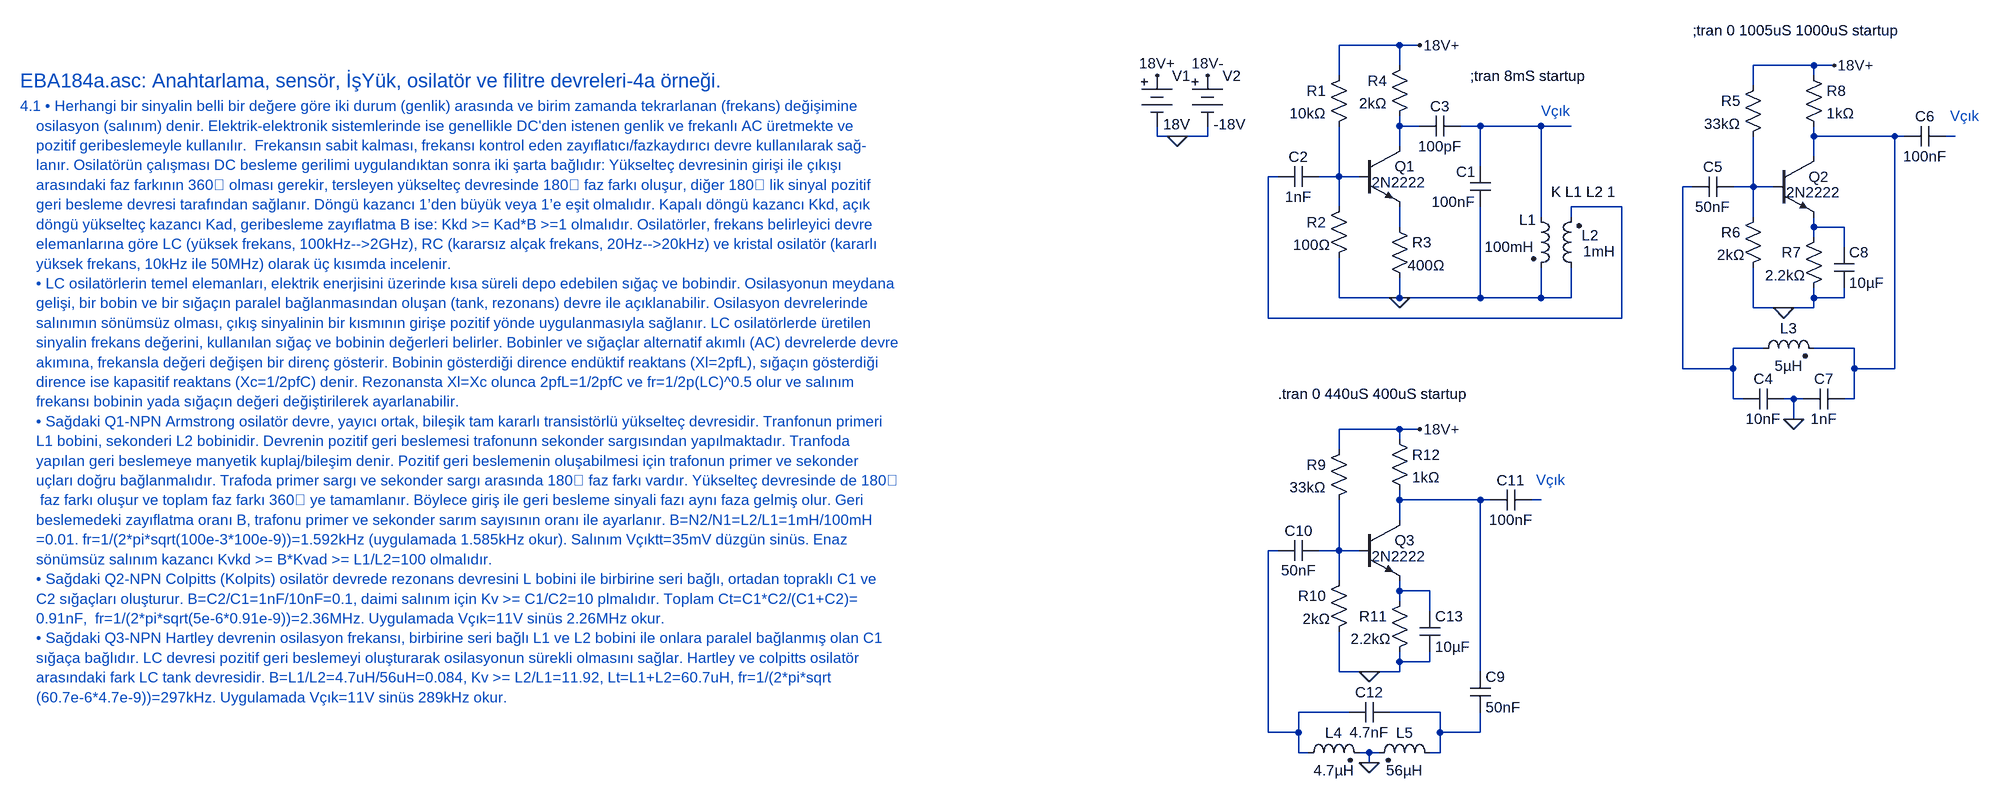
[diagram p0: schematic EBA184a.asc]
EBA184a.asc, the LTspice schematic file:
Version 4
SHEET 1 7064 4332
WIRE 1952 0 1856 0
WIRE 1984 0 1952 0
WIRE 1952 32 1952 0
WIRE 2608 32 2512 32
WIRE 2640 32 2608 32
WIRE 1856 48 1856 0
WIRE 2608 48 2608 32
WIRE 2512 64 2512 32
WIRE 1952 128 1952 112
WIRE 1984 128 1952 128
WIRE 2080 128 2048 128
WIRE 2176 128 2080 128
WIRE 2224 128 2176 128
WIRE 1568 144 1568 128
WIRE 1600 144 1568 144
WIRE 1648 144 1648 128
WIRE 1648 144 1600 144
WIRE 2608 144 2608 128
WIRE 2736 144 2608 144
WIRE 2752 144 2736 144
WIRE 2832 144 2816 144
WIRE 1952 160 1952 128
WIRE 2608 176 2608 144
WIRE 2080 192 2080 128
WIRE 1760 208 1744 208
WIRE 1856 208 1856 128
WIRE 1856 208 1824 208
WIRE 1888 208 1856 208
WIRE 2416 224 2400 224
WIRE 2512 224 2512 144
WIRE 2512 224 2480 224
WIRE 2544 224 2512 224
WIRE 1856 256 1856 208
WIRE 2304 256 2224 256
WIRE 2176 272 2176 128
WIRE 2224 272 2224 256
WIRE 2512 272 2512 224
WIRE 1952 288 1952 256
WIRE 2608 288 2608 272
WIRE 2656 288 2608 288
WIRE 2608 304 2608 288
WIRE 2656 320 2656 288
WIRE 1856 400 1856 336
WIRE 1952 400 1952 368
WIRE 1952 400 1856 400
WIRE 2080 400 2080 256
WIRE 2080 400 1952 400
WIRE 2176 400 2176 352
WIRE 2176 400 2080 400
WIRE 2224 400 2224 352
WIRE 2224 400 2176 400
WIRE 2608 400 2608 384
WIRE 2656 400 2656 384
WIRE 2656 400 2608 400
WIRE 2512 416 2512 352
WIRE 2560 416 2512 416
WIRE 2608 416 2608 400
WIRE 2608 416 2560 416
WIRE 1744 432 1744 208
WIRE 2304 432 2304 256
WIRE 2304 432 1744 432
WIRE 2528 480 2480 480
WIRE 2672 480 2608 480
WIRE 2400 512 2400 224
WIRE 2480 512 2480 480
WIRE 2480 512 2400 512
WIRE 2672 512 2672 480
WIRE 2736 512 2736 144
WIRE 2736 512 2672 512
WIRE 2480 560 2480 512
WIRE 2496 560 2480 560
WIRE 2576 560 2560 560
WIRE 2592 560 2576 560
WIRE 2672 560 2672 512
WIRE 2672 560 2656 560
WIRE 2576 592 2576 560
WIRE 1952 608 1856 608
WIRE 1984 608 1952 608
WIRE 1952 624 1952 608
WIRE 1856 640 1856 608
WIRE 1952 720 1952 704
WIRE 2080 720 1952 720
WIRE 2096 720 2080 720
WIRE 2176 720 2160 720
WIRE 1952 752 1952 720
WIRE 1760 800 1744 800
WIRE 1856 800 1856 720
WIRE 1856 800 1824 800
WIRE 1888 800 1856 800
WIRE 1856 848 1856 800
WIRE 1952 864 1952 848
WIRE 2000 864 1952 864
WIRE 1952 880 1952 864
WIRE 2000 896 2000 864
WIRE 1952 976 1952 960
WIRE 2000 976 2000 960
WIRE 2000 976 1952 976
WIRE 1856 992 1856 928
WIRE 1904 992 1856 992
WIRE 1952 992 1952 976
WIRE 1952 992 1904 992
WIRE 2080 992 2080 720
WIRE 1872 1056 1792 1056
WIRE 2016 1056 1936 1056
WIRE 1744 1088 1744 800
WIRE 1792 1088 1792 1056
WIRE 1792 1088 1744 1088
WIRE 2016 1088 2016 1056
WIRE 2080 1088 2080 1056
WIRE 2080 1088 2016 1088
WIRE 1792 1120 1792 1088
WIRE 1808 1120 1792 1120
WIRE 1904 1120 1888 1120
WIRE 1920 1120 1904 1120
WIRE 2016 1120 2016 1088
WIRE 2016 1120 2000 1120
WIRE 1904 1136 1904 1120
FLAG 1568 48 18V+
FLAG 1600 144 0
FLAG 1648 48 18V-
FLAG 1952 400 0
FLAG 1984 0 18V+
FLAG 2560 416 0
FLAG 2640 32 18V+
FLAG 2576 592 0
FLAG 1904 992 0
FLAG 1984 608 18V+
FLAG 1904 1136 0
SYMBOL Misc\\battery 1568 32 R0
WINDOW 3 10 93 Left 2
SYMATTR Value 18V
SYMATTR InstName V1
SYMBOL Misc\\battery 1648 32 R0
WINDOW 3 10 93 Left 2
SYMATTR Value -18V
SYMATTR InstName V2
SYMBOL npn 1888 160 R0
WINDOW 3 20 57 Left 2
SYMATTR Value 2N2222
SYMATTR InstName Q1
SYMBOL res 1872 32 M0
SYMATTR InstName R1
SYMATTR Value 10kΩ
SYMBOL res 1872 240 M0
WINDOW 3 29 76 Left 2
SYMATTR Value 100Ω
SYMATTR InstName R2
SYMBOL res 1936 272 R0
WINDOW 3 29 76 Left 2
SYMATTR Value 400Ω
SYMATTR InstName R3
SYMBOL cap 2096 192 M0
SYMATTR InstName C1
SYMATTR Value 100nF
SYMBOL ind2 2160 256 R0
WINDOW 0 -19 20 Left 2
WINDOW 3 -73 63 Left 2
SYMATTR InstName L1
SYMATTR Value 100mH
SYMATTR Type ind
SYMBOL ind2 2240 368 R180
WINDOW 0 -27 67 Left 2
WINDOW 3 -54 42 Left 2
SYMATTR InstName L2
SYMATTR Value 1mH
SYMATTR Type ind
SYMBOL cap 1824 224 M270
WINDOW 0 32 32 VTop 2
WINDOW 3 0 32 VBottom 2
SYMATTR InstName C2
SYMATTR Value 1nF
SYMBOL res 1968 16 M0
SYMATTR InstName R4
SYMATTR Value 2kΩ
SYMBOL cap 2048 144 M270
WINDOW 0 32 32 VTop 2
WINDOW 3 0 32 VBottom 2
SYMATTR InstName C3
SYMATTR Value 100pF
SYMBOL npn 2544 176 R0
WINDOW 3 20 57 Left 2
SYMATTR Value 2N2222
SYMATTR InstName Q2
SYMBOL res 2528 48 M0
SYMATTR InstName R5
SYMATTR Value 33kΩ
SYMBOL res 2528 256 M0
WINDOW 3 29 76 Left 2
SYMATTR Value 2kΩ
SYMATTR InstName R6
SYMBOL res 2624 288 M0
WINDOW 3 29 76 Left 2
SYMATTR Value 2.2kΩ
SYMATTR InstName R7
SYMBOL cap 2560 576 M270
WINDOW 0 32 32 VTop 2
WINDOW 3 0 32 VBottom 2
SYMATTR InstName C4
SYMATTR Value 10nF
SYMBOL ind2 2512 496 R270
WINDOW 0 32 56 VTop 2
WINDOW 3 4 56 VBottom 2
SYMATTR InstName L3
SYMATTR Value 5µH
SYMATTR Type ind
SYMBOL cap 2480 240 M270
WINDOW 0 32 32 VTop 2
WINDOW 3 0 32 VBottom 2
SYMATTR InstName C5
SYMATTR Value 50nF
SYMBOL res 2592 32 R0
SYMATTR InstName R8
SYMATTR Value 1kΩ
SYMBOL cap 2816 160 M270
WINDOW 0 32 32 VTop 2
WINDOW 3 0 32 VBottom 2
SYMATTR InstName C6
SYMATTR Value 100nF
SYMBOL cap 2656 576 M270
WINDOW 0 32 32 VTop 2
WINDOW 3 0 32 VBottom 2
SYMATTR InstName C7
SYMATTR Value 1nF
SYMBOL cap 2640 320 R0
SYMATTR InstName C8
SYMATTR Value 10µF
SYMBOL npn 1888 752 R0
WINDOW 3 20 57 Left 2
SYMATTR Value 2N2222
SYMATTR InstName Q3
SYMBOL res 1872 624 M0
SYMATTR InstName R9
SYMATTR Value 33kΩ
SYMBOL res 1872 832 M0
WINDOW 3 29 76 Left 2
SYMATTR Value 2kΩ
SYMATTR InstName R10
SYMBOL res 1968 864 M0
WINDOW 3 29 76 Left 2
SYMATTR Value 2.2kΩ
SYMATTR InstName R11
SYMBOL ind2 1792 1136 R270
WINDOW 0 32 56 VTop 2
WINDOW 3 4 56 VBottom 2
SYMATTR InstName L4
SYMATTR Value 4.7µH
SYMATTR Type ind
SYMBOL cap 1824 816 M270
WINDOW 0 32 32 VTop 2
WINDOW 3 0 32 VBottom 2
SYMATTR InstName C10
SYMATTR Value 50nF
SYMBOL res 1936 608 R0
SYMATTR InstName R12
SYMATTR Value 1kΩ
SYMBOL cap 2160 736 M270
WINDOW 0 32 32 VTop 2
WINDOW 3 0 32 VBottom 2
SYMATTR InstName C11
SYMATTR Value 100nF
SYMBOL cap 1936 1072 M270
WINDOW 0 32 32 VTop 2
WINDOW 3 0 32 VBottom 2
SYMATTR InstName C12
SYMATTR Value 4.7nF
SYMBOL cap 1984 896 R0
SYMATTR InstName C13
SYMATTR Value 10µF
SYMBOL ind2 2016 1136 M270
WINDOW 0 32 56 VTop 2
WINDOW 3 4 56 VBottom 2
SYMATTR InstName L5
SYMATTR Value 56µH
SYMATTR Type ind
SYMBOL cap 2064 992 R0
SYMATTR InstName C9
SYMATTR Value 50nF
TEXT -232 56 Left 3 ;EBA184a.asc: Anahtarlama, sensör, İşYük, osilatör ve filitre devreleri-4a örneği.
TEXT -232 96 Left 2 ;4.1 • Herhangi bir sinyalin belli bir değere göre iki durum (genlik) arasında ve birim zamanda tekrarlanan (frekans) değişimine \n    osilasyon (salınım) denir. Elektrik-elektronik sistemlerinde ise genellikle DC'den istenen genlik ve frekanlı AC üretmekte ve\n    pozitif geribeslemeyle kullanılır.  Frekansın sabit kalması, frekansı kontrol eden zayıflatıcı/fazkaydırıcı devre kullanılarak sağ-\n    lanır. Osilatörün çalışması DC besleme gerilimi uygulandıktan sonra iki şarta bağlıdır: Yükselteç devresinin girişi ile çıkışı \n    arasındaki faz farkının 360⁰ olması gerekir, tersleyen yükselteç devresinde 180⁰ faz farkı oluşur, diğer 180⁰ lik sinyal pozitif\n    geri besleme devresi tarafından sağlanır. Döngü kazancı 1’den büyük veya 1’e eşit olmalıdır. Kapalı döngü kazancı Kkd, açık\n    döngü yükselteç kazancı Kad, geribesleme zayıflatma B ise: Kkd >= Kad*B >=1 olmalıdır. Osilatörler, frekans belirleyici devre \n    elemanlarına göre LC (yüksek frekans, 100kHz-->2GHz), RC (kararsız alçak frekans, 20Hz-->20kHz) ve kristal osilatör (kararlı\n    yüksek frekans, 10kHz ile 50MHz) olarak üç kısımda incelenir.\n    • LC osilatörlerin temel elemanları, elektrik enerjisini üzerinde kısa süreli depo edebilen sığaç ve bobindir. Osilasyonun meydana \n    gelişi, bir bobin ve bir sığaçın paralel bağlanmasından oluşan (tank, rezonans) devre ile açıklanabilir. Osilasyon devrelerinde \n    salınımın sönümsüz olması, çıkış sinyalinin bir kısmının girişe pozitif yönde uygulanmasıyla sağlanır. LC osilatörlerde üretilen \n    sinyalin frekans değerini, kullanılan sığaç ve bobinin değerleri belirler. Bobinler ve sığaçlar alternatif akımlı (AC) devrelerde devre \n    akımına, frekansla değeri değişen bir direnç gösterir. Bobinin gösterdiği dirence endüktif reaktans (Xl=2pfL), sığaçın gösterdiği \n    dirence ise kapasitif reaktans (Xc=1/2pfC) denir. Rezonansta Xl=Xc olunca 2pfL=1/2pfC ve fr=1/2p(LC)^0.5 olur ve salınım\n    frekansı bobinin yada sığaçın değeri değiştirilerek ayarlanabilir.\n    • Sağdaki Q1-NPN Armstrong osilatör devre, yayıcı ortak, bileşik tam kararlı transistörlü yükselteç devresidir. Tranfonun primeri \n    L1 bobini, sekonderi L2 bobinidir. Devrenin pozitif geri beslemesi trafonunn sekonder sargısından yapılmaktadır. Tranfoda \n    yapılan geri beslemeye manyetik kuplaj/bileşim denir. Pozitif geri beslemenin oluşabilmesi için trafonun primer ve sekonder \n    uçları doğru bağlanmalıdır. Trafoda primer sargı ve sekonder sargı arasında 180⁰ faz farkı vardır. Yükselteç devresinde de 180⁰\n     faz farkı oluşur ve toplam faz farkı 360⁰ ye tamamlanır. Böylece giriş ile geri besleme sinyali fazı aynı faza gelmiş olur. Geri \n    beslemedeki zayıflatma oranı B, trafonu primer ve sekonder sarım sayısının oranı ile ayarlanır. B=N2/N1=L2/L1=1mH/100mH\n    =0.01. fr=1/(2*pi*sqrt(100e-3*100e-9))=1.592kHz (uygulamada 1.585kHz okur). Salınım Vçıktt=35mV düzgün sinüs. Enaz \n    sönümsüz salınım kazancı Kvkd >= B*Kvad >= L1/L2=100 olmalıdır.\n    • Sağdaki Q2-NPN Colpitts (Kolpits) osilatör devrede rezonans devresini L bobini ile birbirine seri bağlı, ortadan topraklı C1 ve \n    C2 sığaçları oluşturur. B=C2/C1=1nF/10nF=0.1, daimi salınım için Kv >= C1/C2=10 plmalıdır. Toplam Ct=C1*C2/(C1+C2)=\n    0.91nF,  fr=1/(2*pi*sqrt(5e-6*0.91e-9))=2.36MHz. Uygulamada Vçık=11V sinüs 2.26MHz okur.\n    • Sağdaki Q3-NPN Hartley devrenin osilasyon frekansı, birbirine seri bağlı L1 ve L2 bobini ile onlara paralel bağlanmış olan C1\n    sığaça bağlıdır. LC devresi pozitif geri beslemeyi oluşturarak osilasyonun sürekli olmasını sağlar. Hartley ve colpitts osilatör \n    arasındaki fark LC tank devresidir. B=L1/L2=4.7uH/56uH=0.084, Kv >= L2/L1=11.92, Lt=L1+L2=60.7uH, fr=1/(2*pi*sqrt\n    (60.7e-6*4.7e-9))=297kHz. Uygulamada Vçık=11V sinüs 289kHz okur.
TEXT 2176 104 Left 2 ;Vçık
TEXT 2064 48 Left 2 !;tran 8mS startup
TEXT 2192 232 Left 2 !K L1 L2 1
TEXT 2824 112 Left 2 ;Vçık
TEXT 2416 -24 Left 2 !;tran 0 1005uS 1000uS startup
TEXT 2168 688 Left 2 ;Vçık
TEXT 1760 552 Left 2 !.tran 0 440uS 400uS startup

The netlist it stands for:
* EBA184a.asc
V1 18V+ 0 18V
V2 18V- 0 -18V
Q1 N001 N006 N009 0 2N2222
R1 18V+ N006 10kΩ
R2 N006 0 100Ω
R3 N009 0 400Ω
C1 N002 0 100nF
L1 N002 0 100mH
L2 0 N005 1mH
C2 N006 N005 1nF
R4 18V+ N001 2kΩ
C3 N002 N001 100pF
Q2 N003 N008 N010 0 2N2222
R5 18V+ N008 33kΩ
R6 N008 0 2kΩ
R7 N010 0 2.2kΩ
C4 0 N007 10nF
L3 N007 N003 5µH
C5 N008 N007 50nF
R8 18V+ N003 1kΩ
C6 N004 N003 100nF
C7 N003 0 1nF
C8 N010 0 10µF
Q3 N011 N014 N015 0 2N2222
R9 18V+ N014 33kΩ
R10 N014 0 2kΩ
R11 N015 0 2.2kΩ
L4 N013 0 4.7µH
C10 N014 N013 50nF
R12 18V+ N011 1kΩ
C11 N012 N011 100nF
C12 N016 N013 4.7nF
C13 N015 0 10µF
L5 N016 0 56µH
C9 N011 N016 50nF
.model NPN NPN
.model PNP PNP
.lib standard.bjt
* EBA184a.asc: Anahtarlama, sensör, İşYük, osilatör ve filitre devreleri-4a örneği.
* 4.1 • Herhangi bir sinyalin belli bir değere göre iki durum (genlik) arasında ve birim zamanda tekrarlanan (frekans) değişimine
*     osilasyon (salınım) denir. Elektrik-elektronik sistemlerinde ise genellikle DC'den istenen genlik ve frekanlı AC üretmekte ve
*     pozitif geribeslemeyle kullanılır.  Frekansın sabit kalması, frekansı kontrol eden zayıflatıcı/fazkaydırıcı devre kullanılarak sağ-
*     lanır. Osilatörün çalışması DC besleme gerilimi uygulandıktan sonra iki şarta bağlıdır: Yükselteç devresinin girişi ile çıkışı
*     arasındaki faz farkının 360⁰ olması gerekir, tersleyen yükselteç devresinde 180⁰ faz farkı oluşur, diğer 180⁰ lik sinyal pozitif
*     geri besleme devresi tarafından sağlanır. Döngü kazancı 1’den büyük veya 1’e eşit olmalıdır. Kapalı döngü kazancı Kkd, açık
*     döngü yükselteç kazancı Kad, geribesleme zayıflatma B ise: Kkd >= Kad*B >=1 olmalıdır. Osilatörler, frekans belirleyici devre
*     elemanlarına göre LC (yüksek frekans, 100kHz-->2GHz), RC (kararsız alçak frekans, 20Hz-->20kHz) ve kristal osilatör (kararlı
*     yüksek frekans, 10kHz ile 50MHz) olarak üç kısımda incelenir.
*     • LC osilatörlerin temel elemanları, elektrik enerjisini üzerinde kısa süreli depo edebilen sığaç ve bobindir. Osilasyonun meydana
*     gelişi, bir bobin ve bir sığaçın paralel bağlanmasından oluşan (tank, rezonans) devre ile açıklanabilir. Osilasyon devrelerinde
*     salınımın sönümsüz olması, çıkış sinyalinin bir kısmının girişe pozitif yönde uygulanmasıyla sağlanır. LC osilatörlerde üretilen
*     sinyalin frekans değerini, kullanılan sığaç ve bobinin değerleri belirler. Bobinler ve sığaçlar alternatif akımlı (AC) devrelerde devre
*     akımına, frekansla değeri değişen bir direnç gösterir. Bobinin gösterdiği dirence endüktif reaktans (Xl=2pfL), sığaçın gösterdiği
*     dirence ise kapasitif reaktans (Xc=1/2pfC) denir. Rezonansta Xl=Xc olunca 2pfL=1/2pfC ve fr=1/2p(LC)^0.5 olur ve salınım
*     frekansı bobinin yada sığaçın değeri değiştirilerek ayarlanabilir.
*     • Sağdaki Q1-NPN Armstrong osilatör devre, yayıcı ortak, bileşik tam kararlı transistörlü yükselteç devresidir. Tranfonun primeri
*     L1 bobini, sekonderi L2 bobinidir. Devrenin pozitif geri beslemesi trafonunn sekonder sargısından yapılmaktadır. Tranfoda
*     yapılan geri beslemeye manyetik kuplaj/bileşim denir. Pozitif geri beslemenin oluşabilmesi için trafonun primer ve sekonder
*     uçları doğru bağlanmalıdır. Trafoda primer sargı ve sekonder sargı arasında 180⁰ faz farkı vardır. Yükselteç devresinde de 180⁰
*      faz farkı oluşur ve toplam faz farkı 360⁰ ye tamamlanır. Böylece giriş ile geri besleme sinyali fazı aynı faza gelmiş olur. Geri
*     beslemedeki zayıflatma oranı B, trafonu primer ve sekonder sarım sayısının oranı ile ayarlanır. B=N2/N1=L2/L1=1mH/100mH
*     =0.01. fr=1/(2*pi*sqrt(100e-3*100e-9))=1.592kHz (uygulamada 1.585kHz okur). Salınım Vçıktt=35mV düzgün sinüs. Enaz
*     sönümsüz salınım kazancı Kvkd >= B*Kvad >= L1/L2=100 olmalıdır.
*     • Sağdaki Q2-NPN Colpitts (Kolpits) osilatör devrede rezonans devresini L bobini ile birbirine seri bağlı, ortadan topraklı C1 ve
*     C2 sığaçları oluşturur. B=C2/C1=1nF/10nF=0.1, daimi salınım için Kv >= C1/C2=10 plmalıdır. Toplam Ct=C1*C2/(C1+C2)=
*     0.91nF,  fr=1/(2*pi*sqrt(5e-6*0.91e-9))=2.36MHz. Uygulamada Vçık=11V sinüs 2.26MHz okur.
*     • Sağdaki Q3-NPN Hartley devrenin osilasyon frekansı, birbirine seri bağlı L1 ve L2 bobini ile onlara paralel bağlanmış olan C1
*     sığaça bağlıdır. LC devresi pozitif geri beslemeyi oluşturarak osilasyonun sürekli olmasını sağlar. Hartley ve colpitts osilatör
*     arasındaki fark LC tank devresidir. B=L1/L2=4.7uH/56uH=0.084, Kv >= L2/L1=11.92, Lt=L1+L2=60.7uH, fr=1/(2*pi*sqrt
*     (60.7e-6*4.7e-9))=297kHz. Uygulamada Vçık=11V sinüs 289kHz okur.
* Vçık
;tran 8mS startup
K L1 L2 1
* Vçık
;tran 0 1005uS 1000uS startup
* Vçık
.tran 0 440uS 400uS startup
.backanno
.end